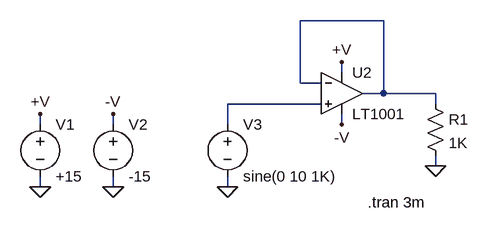
[diagram p0: schematic NoBoyle.asc]
NoBoyle.asc, the LTspice schematic file:
Version 4
SHEET 1 1128 680
WIRE 464 112 336 112
WIRE 400 192 400 176
WIRE 336 208 336 112
WIRE 368 208 336 208
WIRE 464 224 464 112
WIRE 464 224 432 224
WIRE 544 224 464 224
WIRE 368 240 224 240
WIRE 544 240 544 224
WIRE -64 272 -64 256
WIRE 48 272 48 256
WIRE 224 272 224 240
WIRE 400 272 400 256
WIRE 544 336 544 320
WIRE -64 368 -64 352
WIRE 48 368 48 352
WIRE 224 368 224 352
FLAG 400 176 +V
FLAG 400 272 -V
FLAG 48 368 0
FLAG -64 368 0
FLAG -64 256 +V
FLAG 48 256 -V
FLAG 224 368 0
FLAG 544 336 0
SYMBOL voltage -64 256 R0
SYMATTR InstName V1
SYMATTR Value +15
SYMBOL voltage 48 256 R0
SYMATTR InstName V2
SYMATTR Value -15
SYMBOL voltage 224 256 R0
SYMATTR InstName V3
SYMATTR Value sine(0 10 1K)
SYMBOL res 528 224 R0
SYMATTR InstName R1
SYMATTR Value 1K
SYMBOL Opamps\\LT1001 400 160 R0
SYMATTR InstName U2
TEXT 440 392 Left 0 !.tran 3m

The netlist it stands for:
* NoBoyle.asc
V1 +V 0 +15
V2 -V 0 -15
V3 N002 0 sine(0 10 1K)
R1 N001 0 1K
XU2 N002 N001 +V -V N001 LT1001  ; pins In+ In- V+ V- OUT
.tran 3m
.lib LTC.lib
.backanno
.end